# EAGLE schematic minimal serial interface (EAGLE 8.1.0)
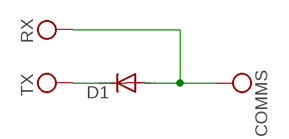
[diagram p0: schematic, sheet 1]

## Parts
D1  1N4148DO35-10  [DO35-10]
Unconnected: D1.A D1.C

## Library data of the parts
D1 = diode:1N4148: DIODE high speed (Philips)